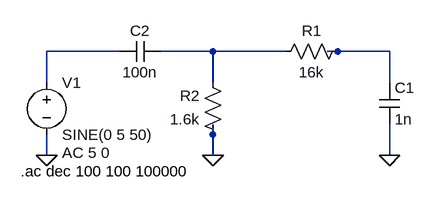
[diagram p0: schematic band_pass_filter.asc]
band_pass_filter.asc, the LTspice schematic file:
Version 4.1
SHEET 1 880 680
WIRE 176 80 64 80
WIRE 320 80 240 80
WIRE 432 80 320 80
WIRE 512 80 496 80
WIRE 592 80 512 80
WIRE 64 128 64 80
WIRE 320 128 320 80
WIRE 592 128 592 80
WIRE 320 208 320 192
WIRE 64 240 64 208
WIRE 320 240 320 208
WIRE 592 240 592 192
FLAG 320 240 0
FLAG 64 240 0
FLAG 592 240 0
SYMBOL voltage 64 112 R0
WINDOW 123 24 124 Left 2
WINDOW 39 0 0 Left 0
SYMATTR InstName V1
SYMATTR Value SINE(0 5 50)
SYMATTR Value2 AC 5 0
SYMBOL res 528 64 R90
WINDOW 0 0 56 VBottom 2
WINDOW 3 32 56 VTop 2
SYMATTR InstName R1
SYMATTR Value 16k
SYMBOL res 336 224 R180
WINDOW 0 36 76 Left 2
WINDOW 3 36 40 Left 2
SYMATTR InstName R2
SYMATTR Value 1.6k
SYMBOL cap 576 128 R0
SYMATTR InstName C1
SYMATTR Value 1n
SYMBOL cap 240 64 R90
WINDOW 0 0 32 VBottom 2
WINDOW 3 32 32 VTop 2
SYMATTR InstName C2
SYMATTR Value 100n
TEXT 24 264 Left 2 !.ac dec 100 100 100000

The netlist it stands for:
* band_pass_filter.asc
V1 N001 0 SINE(0 5 50) AC 5 0
R1 N003 N002 16k
R2 0 N002 1.6k
C1 N003 0 1n
C2 N002 N001 100n
.ac dec 100 100 100000
.backanno
.end